# EAGLE design controller2.4 (EAGLE 7.6.0)
CNAME: timebox controller; CREVISION: 1.0; DESIGNER: volzo
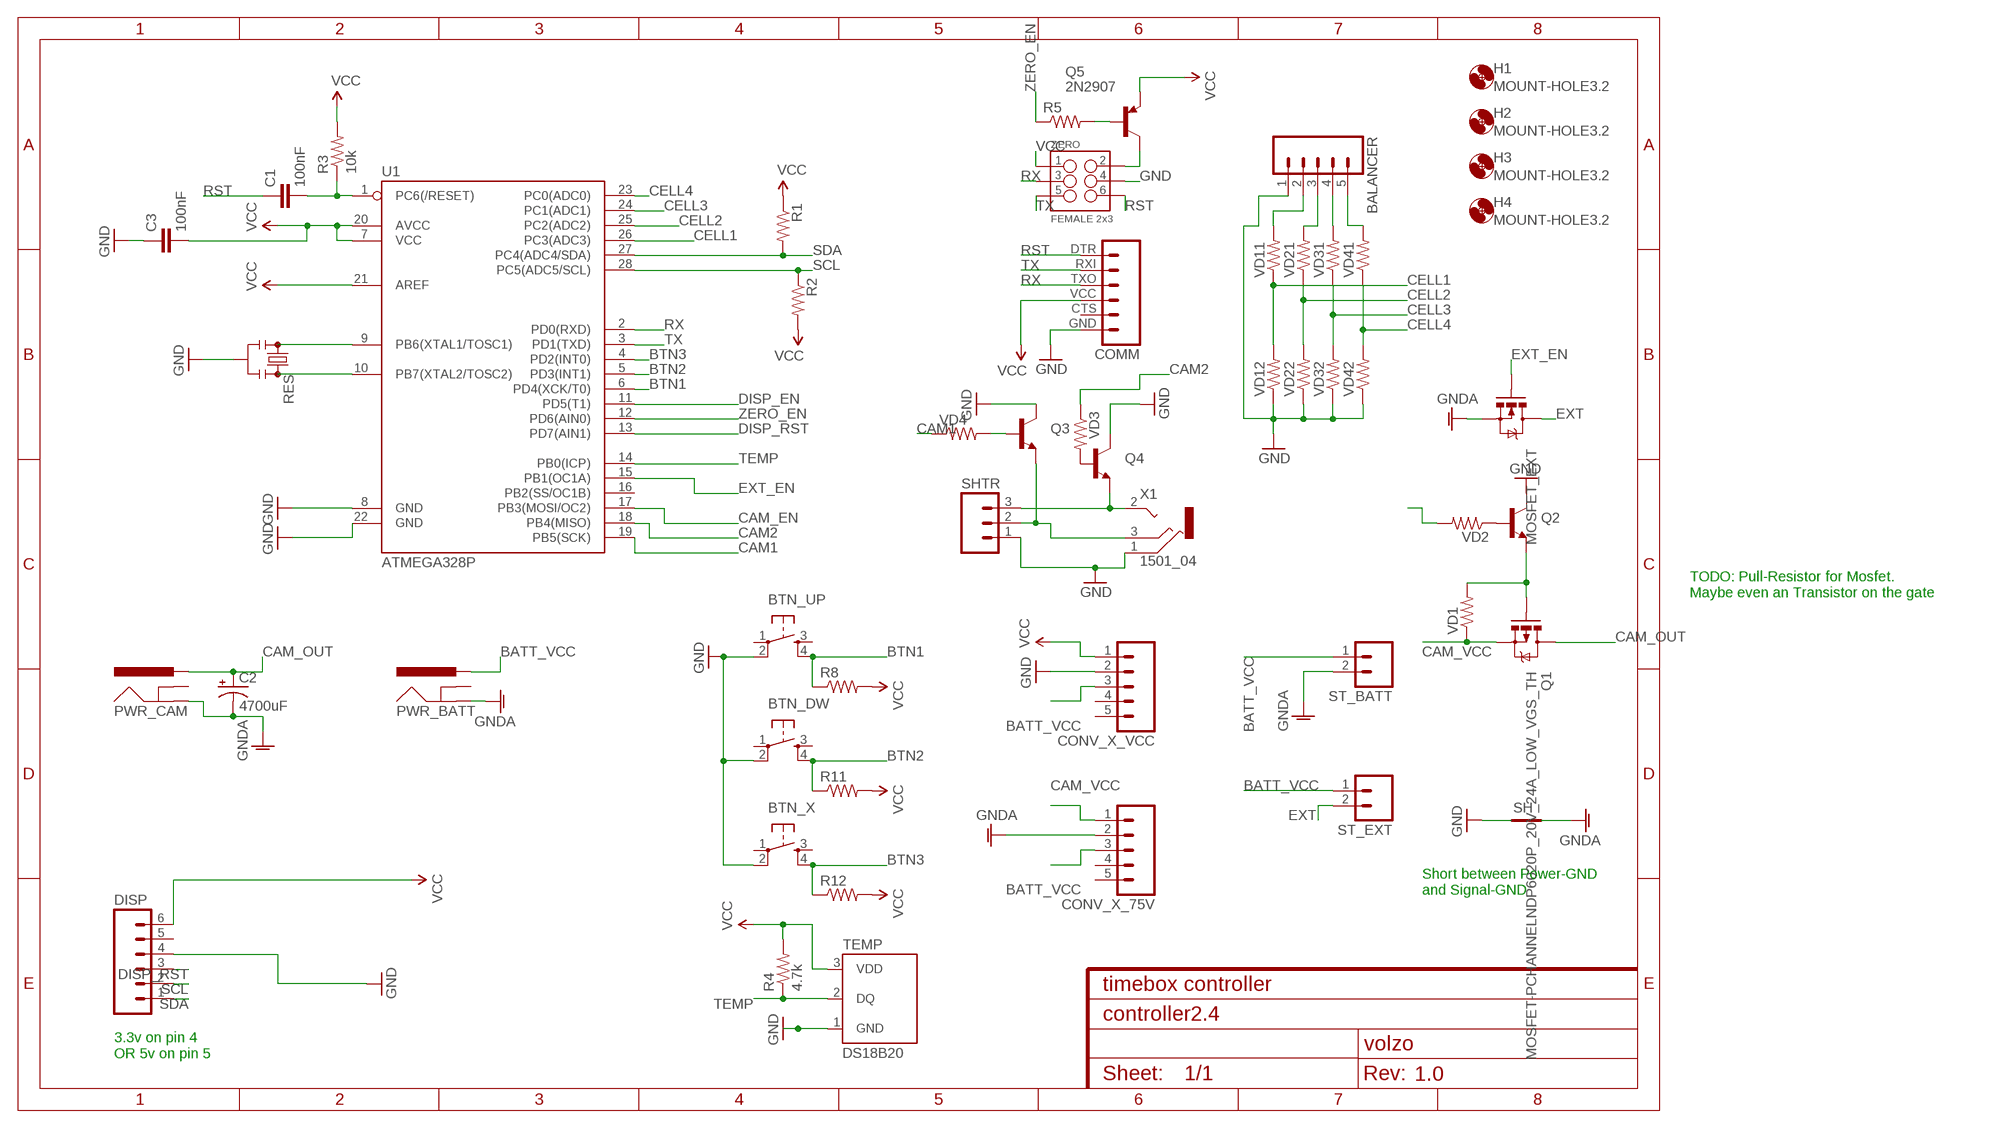
[diagram p0: schematic, sheet 1]

## Parts
BALANCER  M05LOCK  [1X05_LOCK]
BTN_DW  TAC_SWITCHPTH  [TACTILE-PTH]
BTN_UP  TAC_SWITCHPTH  [TACTILE-PTH]
BTN_X  TAC_SWITCHPTH  [TACTILE-PTH]
C1  100nF  CAPPTH  [CAP-PTH-SMALL]
C2  4700uF  CAP_POLPTH3  [CPOL-RADIAL-1000UF-63V]
C3  100nF  CAPPTH  [CAP-PTH-SMALL]
COMM  FTDI_BASICPTH  [FTDI_BASIC]
CONV_X_75V  M05LOCK  [1X05_LOCK]
CONV_X_VCC  M05LOCK  [1X05_LOCK]
DISP  M06FEMALE_LOCK  [1X06_FEMALE_LOCK.010]
H1  MOUNT-HOLE3.2  [3,2]
H2  MOUNT-HOLE3.2  [3,2]
H3  MOUNT-HOLE3.2  [3,2]
H4  MOUNT-HOLE3.2  [3,2]
MOSFET_EXT  MOSFET-NCHANNELFQP30N06L  [TO220V]
PWR_BATT  POWER_JACKPTH_BREAD  [POWER_JACK_PTH_BREAD]
PWR_CAM  POWER_JACKPTH_BREAD  [POWER_JACK_PTH_BREAD]
Q1  MOSFET-PCHANNELNDP6020P_20V_24A_LOW_VGS_TH  [TO220V]
Q2  TRANSISTOR_NPN2N3904  [TO-92]
Q3  TRANSISTOR_NPN2N3904  [TO-92]
Q4  TRANSISTOR_NPN2N3904  [TO-92]
Q5  2N2907  [TO92-EBC-OVAL]
R1  RESISTORAXIAL-0.3  [AXIAL-0.3]
R2  RESISTORAXIAL-0.3  [AXIAL-0.3]
R3  10k  RESISTORAXIAL-0.3  [AXIAL-0.3]
R4  4.7k  RESISTORAXIAL-0.3  [AXIAL-0.3]
R5  RESISTORAXIAL-0.3  [AXIAL-0.3]
R8  RESISTORAXIAL-0.3  [AXIAL-0.3]
R11  RESISTORAXIAL-0.3  [AXIAL-0.3]
R12  RESISTORAXIAL-0.3  [AXIAL-0.3]
RES  RESONATORPTH  [RESONATOR-PTH]
SH  SHORT-HT5  [SHORT_TOP-50]
SHTR  M03LOCK  [1X03_LOCK]
ST_BATT  M025MM  [SCREWTERMINAL-5MM-2]
ST_EXT  M025MM  [SCREWTERMINAL-5MM-2]
TEMP  DS18B20  [TO-92-AMMO]
U1  ATMEGA328P  ATMEGA328P_PDIP  [DIL28-3]
VD1  RESISTORAXIAL-0.3  [AXIAL-0.3]
VD2  RESISTORAXIAL-0.3  [AXIAL-0.3]
VD3  RESISTORAXIAL-0.3  [AXIAL-0.3]
VD4  RESISTORAXIAL-0.3  [AXIAL-0.3]
VD11  RESISTORAXIAL-0.3  [AXIAL-0.3]
VD12  RESISTORAXIAL-0.3  [AXIAL-0.3]
VD21  RESISTORAXIAL-0.3  [AXIAL-0.3]
VD22  RESISTORAXIAL-0.3  [AXIAL-0.3]
VD31  RESISTORAXIAL-0.3  [AXIAL-0.3]
VD32  RESISTORAXIAL-0.3  [AXIAL-0.3]
VD41  RESISTORAXIAL-0.3  [AXIAL-0.3]
VD42  RESISTORAXIAL-0.3  [AXIAL-0.3]
X1  1501_04  [1501_05]
ZERO  FEMALE 2x3  M03X2FEMALE  [2X3]

## Nets
BATT_VCC [power]: CONV_X_75V.3 CONV_X_VCC.3 PWR_BATT.PWR ST_BATT.1 ST_EXT.1
BTN1: BTN_UP.4 R8.P$1 U1.6(PD4(XCK/T0))
BTN2: BTN_DW.4 R11.P$1 U1.5(PD3(INT1))
BTN3: BTN_X.4 R12.P$1 U1.4(PD2(INT0))
CAM1: U1.19(PB5(SCK)) VD4.P$1
CAM2: U1.18(PB4(MISO)) VD3.P$1
CAM_EN: U1.17(PB3(MOSI/OC2)) VD2.P$2
CAM_OUT [power]: C2.1(+) PWR_CAM.PWR Q1.2(D)
CAM_VCC [power]: CONV_X_75V.1 Q1.3(S) VD1.P$1
CELL1: U1.26(PC3(ADC3)) VD11.P$1 VD12.P$2
CELL2: U1.25(PC2(ADC2)) VD21.P$1 VD22.P$2
CELL3: U1.24(PC1(ADC1)) VD31.P$1 VD32.P$2
CELL4: U1.23(PC0(ADC0)) VD41.P$1 VD42.P$2
DISP_EN: U1.11(PD5(T1))
DISP_RST: DISP.3 U1.13(PD7(AIN1))
EXT [power]: MOSFET_EXT.2(D) ST_EXT.2
EXT_EN: MOSFET_EXT.1(G) U1.15(PB1(OC1A))
GND: BALANCER.1 BTN_DW.2 BTN_UP.2 BTN_X.2 C3.1 COMM.GND CONV_X_VCC.2 DISP.4 Q2.3(C) Q3.3(C) Q4.3(C) RES.2 SH.1 SHTR.1 TEMP.1(GND) U1.8(GND) U1.22(GND) VD12.P$1 VD22.P$1 VD32.P$1 VD42.P$1 X1.1 ZERO.4
GNDA [power]: C2.2(-) CONV_X_75V.2 MOSFET_EXT.3(S) PWR_BATT.GND PWR_CAM.GND SH.2 ST_BATT.2
N$1: C1.2 R3.P$1 U1.1(PC6(/RESET))
N$2: Q1.1(G) Q2.1(E) VD1.P$2
N$3: Q3.1(E) SHTR.2 X1.3
N$4: BALANCER.2 VD11.P$2
N$5: BALANCER.3 VD21.P$2
N$6: Q4.1(E) SHTR.3 X1.2
N$7: Q2.2(B) VD2.P$1
N$8: RES.3 U1.10(PB7(XTAL2/TOSC2))
N$9: RES.1 U1.9(PB6(XTAL1/TOSC1))
N$10: BALANCER.4 VD31.P$2
N$11: BALANCER.5 VD41.P$2
N$12: Q5.C ZERO.2
N$13: Q3.2(B) VD4.P$2
N$14: Q4.2(B) VD3.P$2
N$15: Q5.B R5.P$2
RST: C1.1 COMM.DTR ZERO.6
RX: COMM.TXO U1.2(PD0(RXD)) ZERO.3
SCL: DISP.2 R2.P$1 U1.28(PC5(ADC5/SCL))
SDA: DISP.1 R1.P$2 U1.27(PC4(ADC4/SDA))
TEMP: R4.P$1 TEMP.2(DQ) U1.14(PB0(ICP))
TX: COMM.RXI U1.3(PD1(TXD)) ZERO.5
VCC: C3.2 COMM.VCC CONV_X_VCC.1 DISP.6 Q5.E R1.P$1 R2.P$2 R3.P$2 R4.P$2 R8.P$2 R11.P$2 R12.P$2 TEMP.3(VDD) U1.7(VCC) U1.20(AVCC) U1.21(AREF) ZERO.1
ZERO_EN: R5.P$1 U1.12(PD6(AIN0))
Unconnected: BTN_DW.1 BTN_DW.3 BTN_UP.1 BTN_UP.3 BTN_X.1 BTN_X.3 COMM.CTS CONV_X_75V.4 CONV_X_75V.5 CONV_X_VCC.4 CONV_X_VCC.5 DISP.5 PWR_BATT.GNDBREAK PWR_CAM.GNDBREAK U1.16(PB2(SS/OC1B))

## Notes on the sheet
- TODO: Pull-Resistor for Mosfet.
  Maybe even an Transistor on the gate
- Short between Power-GND
  and Signal-GND
- 3.3v on pin 4
  OR 5v on pin 5

## Library data of the parts
BALANCER CONV_X_75V CONV_X_VCC = SparkFun-Connectors:M05: Header 5 Standard 5-pin 0.1" header. Use with straight break away headers (SKU : PRT-00116), right angle break away headers (PRT-00553), swiss pins (PRT-00743), machine pins (PRT-00117), and female headers (PRT-00115). Molex polarized connector foot print use with SKU : PRT-08230 with associated crimp pins and housings.
BTN_DW BTN_UP BTN_X = SparkFun-Retired:TAC_SWITCH: Momentary Switch Button commonly used for reset or general input. Spark Fun Electronics SKU : COM-00097 SMT- SWCH-08247
C1 C3 = SparkFun-Passives:CAP: Capacitor Standard 0603 ceramic capacitor, and 0.1" leaded capacitor.
C2 = SparkFun-Passives:CAP_POL: Capacitor Polarized These are standard SMD and PTH capacitors. Normally 10uF, 47uF, and 100uF in electrolytic and tantalum varieties. Always verify the external diameter of the through hole cap, it varies with capacity, voltage, and manufacturer. The EIA devices should be standard.
COMM = SparkFun-Connectors:FTDI_BASIC: FTDI Basic header with labels
DISP = SparkFun-Connectors:M06: Header 6 Standard 6-pin 0.1" header. Use with straight break away headers (SKU : PRT-00116), right angle break away headers (PRT-00553), swiss pins (PRT-00743), machine pins (PRT-00117), and female headers (PRT-00115). Molex polarized connector foot print use with SKU : PRT-08094 with associated crimp pins and housings. NOTES ON THE VARIANTS LOCK and LOCK_LONGPADS... This footprint was designed to help hold the alignment of a through-hole component (i.e. 6-pin header) while soldering it into place. You may notice that each hole has been shifted either up or down by 0.005 of an inch from it's more standard position (which is a perfectly straight line). This slight alteration caused the pins (the squares in the middle) to touch the edges of the holes. Because they are alternating, it causes a "brace" to hold the component in place. 0.005 has proven to be the perfect amount of "off-center" position when using our standard breakaway headers. Although looks a little odd when you look at the bare footprint, once you have a header in there, the alteration is very hard to notice. Also,if you push a header all the way into place, it is covered up entirely on the bottom side. This idea of altering the position of holes to aid alignment will be further integrated into the Sparkfun Library for other footprints. It can help hold any component with 3 or more connection pins.
H1-H4 = holes:MOUNT-HOLE: MOUNTING HOLE with drill center marker
MOSFET_EXT = SparkFun-DiscreteSemi:MOSFET-NCHANNEL: Common NMOSFET Parts MFG P/N Store ID Prod ID FDD8780 TRANS-09984 SI7820DN TRANS-11055 FDS6630A IC-08089 2N7002PW TRANS-11151 FQP30N06L COM-10213 TRANS-10060 BSS123LT1G TRANS-08345 BSS138 TRANS-00830 BS170 2N7000; PROD_ID: TRANS-10060
PWR_BATT PWR_CAM = SparkFun-Connectors:POWER_JACK: Power Jack This is the standard 5.5mm barrel jack for power. The PTH is the most common, proven, reliable, footprint. The Slot footprint only works if the mill layer is transmitted to the PCB fab house so be warned. Mating wall wart : TOL-00298 (and others); PROD_ID: PRT-10811
Q1 = SparkFun-DiscreteSemi:MOSFET-PCHANNEL: Generic PMOSFET IRLML2244 - TRANS-11153 (SOT-23 -20V -4.3A) (1.Gate 2.Source 3.Drain) FQP27P06 - COM-10349 <http://www.sparkfun.com/products/10349> (TO-220 -60V -27A) (1.Gate 2.Source 3.Drain); PROD_ID: TRANS-13060
Q2-Q4 = SparkFun-DiscreteSemi:TRANSISTOR_NPN: Generic NPN BJT MMBT2222A - TRANS-08049 (SOT-23, 1A 40V) MPSA42 - TRANS-09116 (SOT-23, 500mA 300V) MMBT5088LT1G - TRANS-11160 (SOT-23, 50 mA 30V) BC547 - COM-08928 <http://www.sparkfun.com/products/8928> (TO-92 45V 100mA) (1.Collector 2.Base 3.Emitter) 2N3904 - COM-00521 <http://www.sparkfun.com/products/521> (TO-92 40V 200mA) (1.Emitter 2.Base 3.Collector) P2N2222A - COM-12852 <http://www.sparkfun.com/products/12852> (TO-92 40V 600mA) (1.Collector 2.Base 3.Emitter); PROD_ID: TRANS-08447
Q5 = adafruit:2N2907*: PNP Transistor Big Oval pads
R1-R5 R8 R11 R12 VD1-VD4 VD11 VD12 VD21 VD22 VD31 VD32 VD41 VD42 = SparkFun-Resistors:RESISTOR: Resistor Basic schematic elements and footprints for 0603, 1206, and PTH resistors.
RES = SparkFun-FreqCtrl:RESONATOR: Resonator Small SMD resonator. Used, eg, on the Arduino Pro/ Pro Mini boards. 8MHz- XTAL-08895 16MHz- XTAL-08900
SH = shorts-old:SHORT-H: Short between two nets; BOM: no
SHTR = SparkFun-Connectors:M03: Header 3 Standard 3-pin 0.1" header. Use with straight break away headers (SKU : PRT-00116), right angle break away headers (PRT-00553), swiss pins (PRT-00743), machine pins (PRT-00117), and female headers (PRT-00115). Molex polarized connector foot print use with SKU : PRT-08232 with associated crimp pins and housings.
ST_BATT ST_EXT = SparkFun-Connectors:M02: Standard 2-pin 0.1" header. Use with - straight break away headers ( PRT-00116) - right angle break away headers (PRT-00553) - swiss pins (PRT-00743) - machine pins (PRT-00117) - female headers (PRT-00115) Molex polarized connector foot print use with: PRT-08233 with associated crimp pins and housings. 2.54_SCREWTERM for use with PRT-10571. 3.5mm Screw Terminal footprints for PRT-08084 5mm Screw Terminal footprints for use with PRT-08432; STOREFRONT_ID: PRT-08432
TEMP = SparkFun-Sensors:DS18B20: Dallas/Maxim DS18B20 1-wire temperature sensor Datasheet: http://datasheets.maximintegrated.com/en/ds/DS18B20.pdf temp thermometer 1-wire one-wire one wire; STORE_ID: SEN-00245
U1 = SparkFun-DigitalIC:ATMEGA328P_PDIP: uC used in the Arduino 32kb flash, 1k EEPROM, 2k SRAM This is the through-hole version of this chip.
X1 = con-lumberg:1501_0*: Jack connectors according to JISC 6560, 2.5 mm Klinkensteckverbinder nach JISC 6560, 2,5 mm Source: http://www.lumberg.com/Produkte/PDFs/1501_05.pdfedit 1501_03 http://www.lumberg.com/Produkte/PDFs/1501_06.pdf; OC_FARNELL: 1216977; OC_NEWARK: unknown
ZERO = SparkFun-Connectors:M03X2: 2x3 .1" header. Shrouded, with keying- CONN-10681 SMT- CONN-11415 Pogo pins- HW-11044; PROD_ID: CONN-11566

## Net classes
0 default: width 0.254 mm
1 power: width 0.762 mm, clearance 0.254 mm

## Board
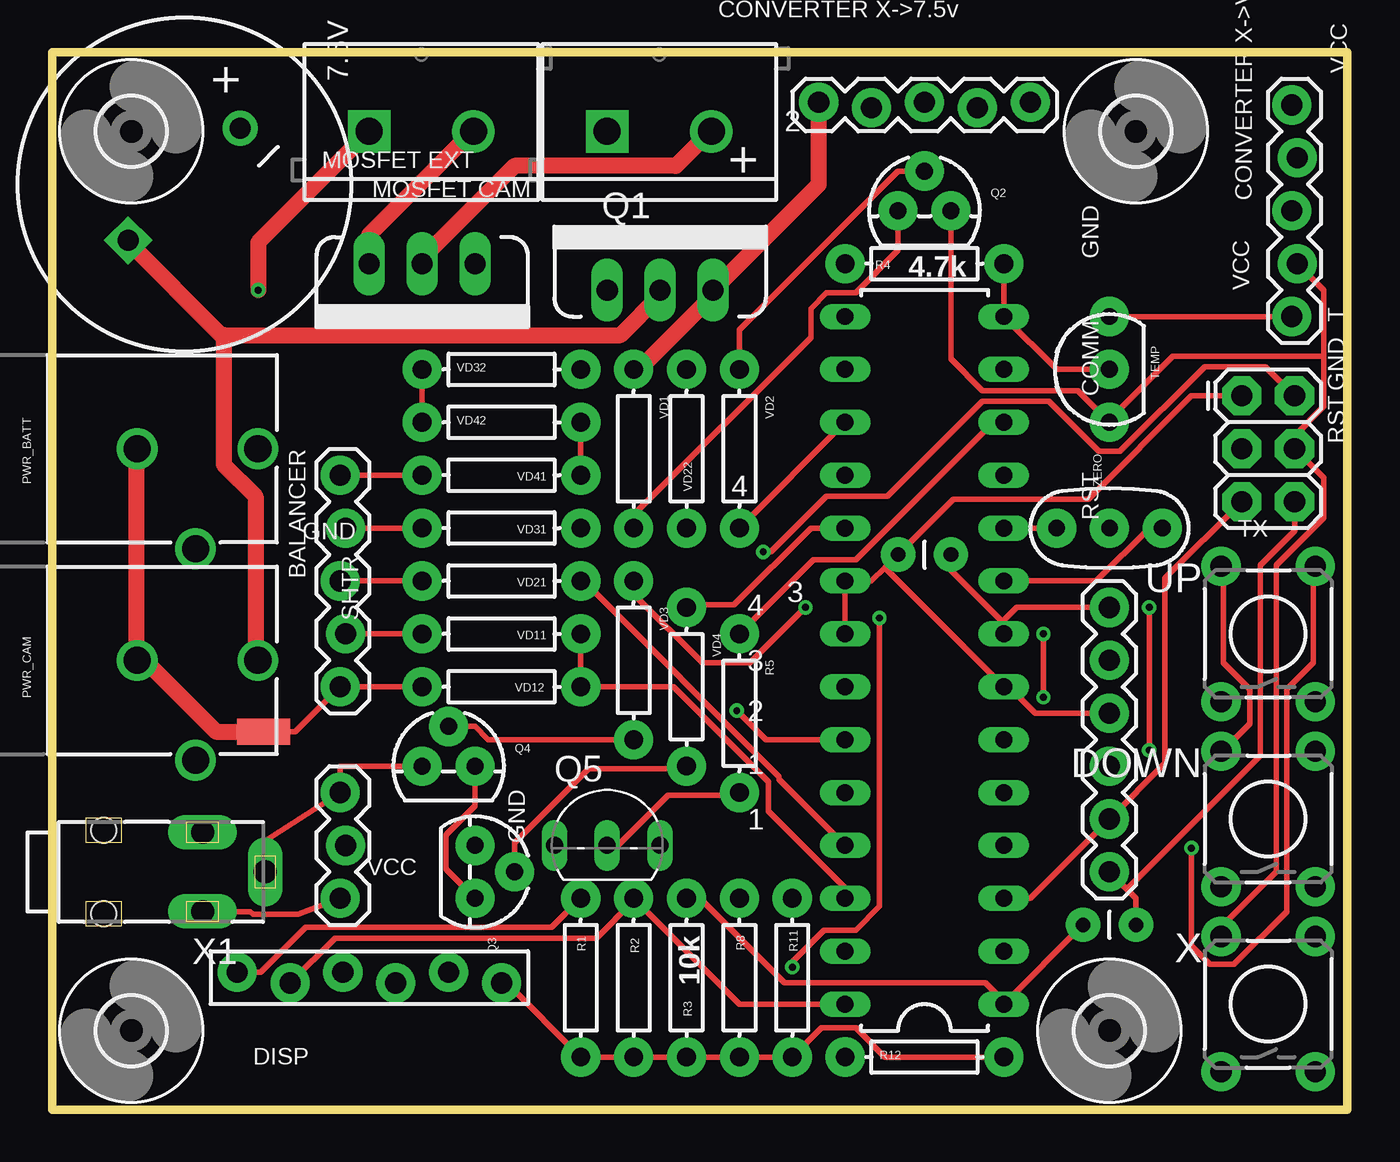
[diagram p1: board, top side]
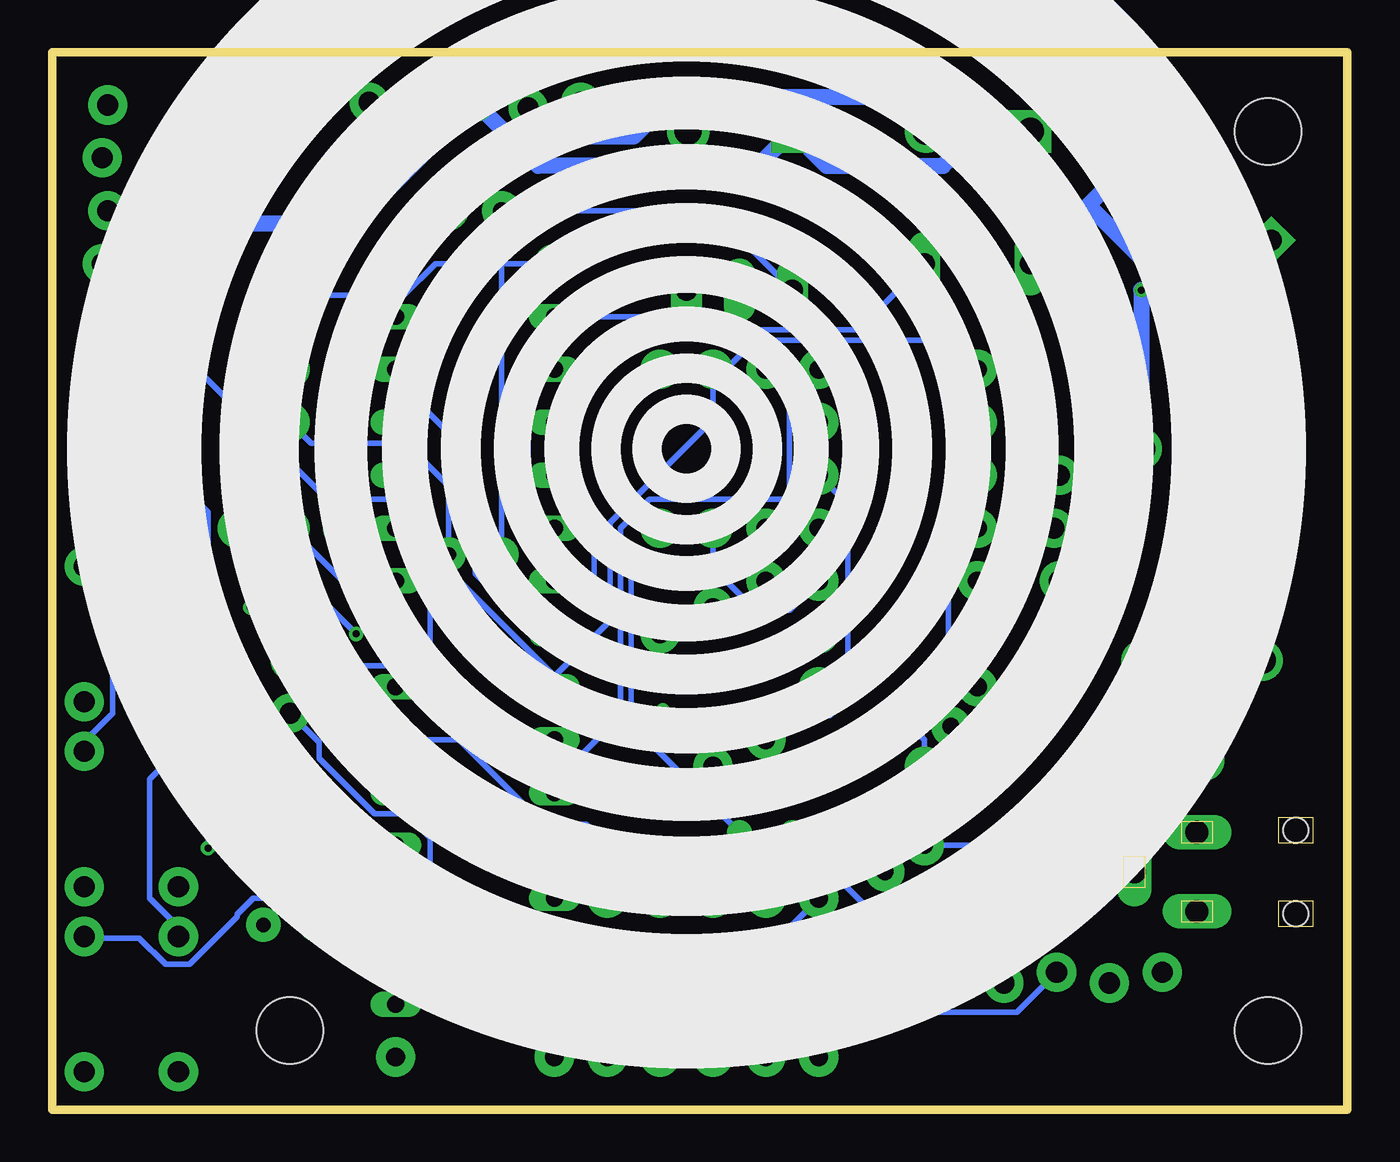
[diagram p2: board, bottom side, seen from below]

Size 62.23 x 50.8 mm. Coordinates in mm from the lower left corner, seen from the top.
Outline: 0,0 62.23,0 62.23,50.8 0,50.8 0,0
Copper layers (1*16): Top 0.0356mm / dielectric 1.5011mm / Bottom 0.0356mm
Design rules "oshpark-2layer *": minimum track width 6mil, minimum drill 13mil, track to track 10mil, track to pad 10mil, pad to pad 10mil, via to via 10mil, smd to smd 10mil, copper to edge 15mil, drill to drill 6mil, minimum pad ring 7mil, minimum via ring 7mil, stop-mask expansion 2.5mil, vias tented up to drill 0mil, thermal gap 10mil

### Footprints (pad centres in the part's own frame; a part is rotated, then mirrored left to right if it is on the bottom)
1X05_LOCK = drill 1.016 pad 1.88: 1 0,0.127; 2 2.54,-0.127; 3 5.08,0.127; 4 7.62,-0.127; 5 10.16,0.127
TACTILE-PTH = drill 1.016 pad 1.88: 1 -3.251,2.261; 2 3.251,2.261; 3 -3.251,-2.261; 4 3.251,-2.261
CAP-PTH-SMALL = drill 0.7 pad 1.651: 1 0,0; 2 2.54,0
CPOL-RADIAL-1000UF-63V = drill 1.016 pad 1.651 square: 1 3.81,0 | drill 1.016 pad 1.676: 2 -3.81,0
FTDI_BASIC = drill 1.016 pad 1.88: CTS 10.16,0; DTR 0,0; GND 12.7,0; RXI 2.54,0; TXO 5.08,0; VCC 7.62,0
1X06_FEMALE_LOCK.010 = drill 1.016 pad 1.88: 1 0,0.254; 2 2.54,-0.254; 3 5.08,0.254; 4 7.62,-0.254; 5 10.16,0.254; 6 12.7,-0.254
3,2 = hole 3.2: 0,0
TO220V = drill 1.016 long: 1 -2.54,0; 2 0,0; 3 2.54,0
POWER_JACK_PTH_BREAD = drill 1.3: GND 0,7.9; GNDBREAK 4.8,10.7; PWR 0,13.7
TO-92 = drill 0.813 pad 1.88: 1 -1.27,0; 2 0,1.905; 3 1.27,0
TO92-EBC-OVAL = drill 0.813 long: B 0,-1.27; C 2.54,-1.27; E -2.54,-1.27
AXIAL-0.3 = drill 0.9 pad 1.88: P$1 -3.81,0; P$2 3.81,0
RESONATOR-PTH = drill 0.8 pad 1.88: 1 -2.54,0; 2 0,0; 3 2.54,0
SHORT_TOP-50 = smd 1.27 x 1.27: 1 0.635,0; 2 -0.635,0
1X03_LOCK = drill 1.016 pad 1.88: 1 0,0.127; 2 2.54,-0.127; 3 5.08,0.127
SCREWTERMINAL-5MM-2 = drill 1.3 pad 2.032 square: 1 0,0 | drill 1.3 pad 2.032: 2 5,0
TO-92-AMMO = drill 0.813 pad 1.88: 1 -2.54,0; 2 0,0; 3 2.54,0
DIL28-3 = drill 0.813 long: 1 -16.51,-3.81; 2 -13.97,-3.81; 3 -11.43,-3.81; 4 -8.89,-3.81; 5 -6.35,-3.81; 6 -3.81,-3.81; 7 -1.27,-3.81; 8 1.27,-3.81; 9 3.81,-3.81; 10 6.35,-3.81; 11 8.89,-3.81; 12 11.43,-3.81; 13 13.97,-3.81; 14 16.51,-3.81; 15 16.51,3.81; 16 13.97,3.81; 17 11.43,3.81; 18 8.89,3.81; 19 6.35,3.81; 20 3.81,3.81; 21 1.27,3.81; 22 -1.27,3.81; 23 -3.81,3.81; 24 -6.35,3.81; 25 -8.89,3.81; 26 -11.43,3.81; 27 -13.97,3.81; 28 -16.51,3.81
1501_05 = drill 1.1 pad 1.4 long: 1 -1.9,-8.5; 2 0,-11.5; 3 1.9,-8.5 | hole 1.2: -2,-3.75; 2,-3.75
2X3 = drill 1.016 pad 1.88 octagon: 1 0,0; 2 0,2.54; 3 2.54,0; 4 2.54,2.54; 5 5.08,0; 6 5.08,2.54

### Placement (x,y rotation side)
BALANCER  13.97,20.32 90 top
BTN_DW  58.42,13.97 90 top
BTN_UP  58.42,22.86 90 top
BTN_X  58.42,5.08 90 top
C1  52.07,8.89 180 top
C2  6.35,44.45 225 top
C3  43.18,26.67 180 top
COMM  50.8,11.43 90 top
CONV_X_75V  36.83,48.26 0 top
CONV_X_VCC  59.69,38.1 90 top
DISP  8.89,6.35 0 top
H1  3.81,46.99 0 top
H2  50.8,3.81 0 top
H3  52.07,46.99 0 top
H4  3.81,3.81 0 top
MOSFET_EXT  17.78,40.64 180 top
PWR_BATT  -3.81,31.75 270 top
PWR_CAM  -3.81,21.59 270 top
Q1  29.21,39.37 0 top
Q2  41.91,43.18 0 top
Q3  20.32,11.43 270 top
Q4  19.05,16.51 0 top
Q5  26.67,13.97 0 top
R1  25.4,6.35 90 top
R2  27.94,6.35 270 top
R3  30.48,6.35 270 top
R4  41.91,40.64 180 top
R5  33.02,19.05 270 top
R8  33.02,6.35 270 top
R11  35.56,6.35 270 top
R12  41.91,2.54 0 top
RES  50.8,27.94 180 top
SH  10.16,18.16 0 top
SHTR  13.97,10.16 90 top
ST_BATT  15.24,46.99 0 top
ST_EXT  26.67,46.99 0 top
TEMP  50.8,35.56 90 top
U1  41.91,21.59 90 top
VD1  27.94,31.75 270 top
VD2  33.02,31.75 270 top
VD3  27.94,21.59 270 top
VD4  30.48,20.32 270 top
VD11  21.59,22.86 180 top
VD12  21.59,20.32 0 top
VD21  21.59,25.4 180 top
VD22  30.48,31.75 270 top
VD31  21.59,27.94 180 top
VD32  21.59,35.56 0 top
VD41  21.59,30.48 180 top
VD42  21.59,33.02 0 top
X1  -1.27,11.43 90 top
ZERO  57.15,34.29 270 top

### Tracks (layer width: path | path; a pad name or v marks a point on that pad's centre or on a via)
BATT_VCC  (via drill 0.33)
  Top 0.762: v9.91,39.37 9.91,41.66 ST_BATT.1
  Bottom 0.762: v9.91,39.37 9.91,31.75 PWR_BATT.PWR | CONV_X_VCC.3 54.48,43.18 53.85,42.55 47.75,42.55 CONV_X_75V.3 38.86,45.34 28.32,45.34 ST_EXT.1 25.02,45.34 19.43,45.34 17.78,46.99 ST_BATT.1
BTN1  (via drill 0.33)
  Top 0.254: v54.74,12.57 54.74,7.87 55.63,6.99 56.77,6.99 59.31,9.53 59.31,20.19 60.58,21.46 60.58,26.04 BTN_UP.4 | v52.7,24.13 v52.7,17.27 | v47.62,19.81 v47.62,22.86
  Bottom 0.254: 45.59,17.78 42.67,17.78 38.61,13.72 36.58,13.72 R8.P$1 | v54.74,12.57 54.74,15.24 v52.7,17.27 | v52.7,24.13 51.31,25.53 50.29,25.53 v47.62,22.86 | 45.59,17.78 v47.62,19.81 | 45.59,17.78 U1.6
BTN2
  Bottom 0.254: R11.P$1 36.58,11.18 38.61,11.18 42.67,15.24 U1.5 48.39,17.91 48.39,20.19 47.24,21.34 45.21,21.34 44.07,22.48 44.07,25.78 44.45,26.16 44.45,27.18 44.07,27.56 44.07,28.32 45.09,29.34 49.02,29.34 55.37,35.69 60.2,35.69 61.09,34.8 61.09,28.7 59.31,26.92 59.31,19.05 60.58,17.78 60.58,17.27 BTN_DW.4
BTN3
  Bottom 0.254: U1.4 45.72,12.19 42.35,8.83 | 42.35,8.83 39.75,6.22 39.75,4.19 R12.P$1 | 42.35,8.83 44.58,6.6 46.74,6.6 47.37,7.24 47.37,8.51 49.02,10.16 50.04,10.16 50.16,10.03 51.31,10.03 51.44,10.16 52.58,10.16 53.34,9.4 53.34,9.27 55.63,6.99 56.77,6.99 58.04,8.26 60.58,8.26 BTN_X.4
CAM1
  Top 0.254: U1.19 36.45,27.94 32.77,24.26 30.61,24.26 VD4.P$1
CAM2  (via drill 0.33)
  Top 0.254: v36.2,24.13 33.53,21.46 31.24,21.46 27.94,24.77 VD3.P$1
  Bottom 0.254: U1.18 38.1,29.97 36.2,28.07 v36.2,24.13
CAM_EN
  Top 0.254: VD2.P$2 U1.17
CAM_OUT
  Top 0.762: Q1.2 29.21,39.12 27.3,37.21 8.26,37.21 | 8.26,37.21 8.13,37.21 3.68,41.66 C2.1 | 8.26,37.21 8.26,30.99 9.78,29.46 9.78,21.59 PWR_CAM.PWR
CAM_VCC
  Top 0.762: VD1.P$1 28.19,35.56 31.75,39.12 Q1.3 36.83,44.45 CONV_X_75V.1
CELL1
  Top 0.254: U1.26 38.1,10.67 34.42,14.35 34.42,15.75 29.84,20.32 VD12.P$2 VD11.P$1
CELL2
  Top 0.254: U1.25 34.92,15.88 34.92,16 25.53,25.4 VD21.P$1
  Bottom 0.254: VD22.P$2 30.48,26.04 28.45,24 26.8,24 VD21.P$1
CELL3
  Bottom 0.254: U1.24 38.1,15.75 34.92,18.92 34.92,27.94 33.53,29.34 26.8,29.34 | VD31.P$1 26.8,29.34 | VD32.P$2 25.4,34.92 26.8,33.53 26.8,29.34
CELL4  (via drill 0.33)
  Top 0.254: U1.23 34.29,17.78 v32.89,19.18 | VD41.P$1 VD42.P$2
  Bottom 0.254: v32.89,19.18 26.16,19.18 25.91,18.92 24.89,18.92 24,19.81 24,29.08 VD41.P$1
DISP_RST  (via drill 0.33)
  Top 0.254: v39.75,23.62 39.75,9.78 38.61,8.64 37.08,8.64 35.56,7.11 v35.56,6.86
  Bottom 0.254: U1.13 45.72,35.05 41.91,31.24 41.91,25.78 v39.75,23.62 | v35.56,6.86 24.26,6.86 22.1,4.7 15.88,4.7 DISP.3
EXT
  Top 0.762: MOSFET_EXT.2 17.78,40.89 22.23,45.34 29.97,45.34 31.62,46.99 ST_EXT.2
EXT_EN
  Bottom 0.254: U1.15 32.89,38.1 32.26,37.47 23.5,37.47 MOSFET_EXT.1
GND
  Top 0.254: VD32.P$1 VD42.P$1 | SH.1 11.68,18.16 BALANCER.1 VD12.P$1 | SHTR.1 11.81,9.4 9.65,9.4 9.53,9.53 X1.1 | Q4.3 20.32,14.61 18.92,13.21 18.92,11.56 Q3.3 | U1.8 45.72,23.37 45.66,23.43 | 45.66,23.43 43.18,25.91 C3.1 | COMM.GND 46.35,24.13 45.66,23.43 | BTN_UP.2 56.26,26.04 56.26,21.46 57.53,20.19 57.53,18.54 56.26,17.27 BTN_DW.2 | 61.09,36.2 61.09,39.37 CONV_X_VCC.2 | 61.09,36.2 61.09,33.78 59.69,32.38 ZERO.4 61.09,30.35 61.09,28.45 58.8,26.16 58.8,11.43 56.26,8.89 56.26,8.38 BTN_X.2 | Q2.3 43.18,36.07 44.7,34.54 49.28,34.54 TEMP.1 50.8,33.15 53.85,36.2 61.09,36.2
  Bottom 0.254: VD32.P$1 19.18,36.96 28.45,36.96 29.84,35.56 VD22.P$1 30.48,33.15 35.43,28.19 35.43,23.5 38.1,20.83 | Q4.3 20.32,17.78 20.45,17.91 20.45,18.92 19.11,20.26 | 19.11,20.26 19.05,20.32 VD12.P$1 | Q3.3 16.51,6.35 DISP.4 16.51,6.48 12.83,10.16 SHTR.1 | VD42.P$1 17.78,32.38 19.18,30.99 19.18,20.32 19.11,20.26 | 38.1,20.83 43.18,25.91 C3.1 43.18,29.97 45.21,32 49.78,32 TEMP.1 | U1.8 RES.2 | BTN_X.2 56.26,8.38 56.26,8.89 57.53,10.16 57.53,15.88 56.26,17.14 BTN_DW.2 | 38.1,20.83 U1.22
GNDA
  Top 0.762: SH.2 7.87,18.16 4.45,21.59 PWR_CAM.GND 4.06,21.84 4.06,31.75 PWR_BATT.GND | MOSFET_EXT.3 15.24,42.04 20.19,46.99 ST_BATT.2
  Bottom 0.762: MOSFET_EXT.3 12.45,43.43 | 12.45,43.43 9.14,46.74 9.14,47.12 C2.2 | CONV_X_75V.2 38.86,48.13 37.47,46.74 34.29,46.74 32.38,48.64 21.97,48.64 20.32,46.99 ST_BATT.2 | 12.45,43.43 4.19,35.18 4.19,31.75 PWR_BATT.GND
N$1
  Top 0.254: C1.2 U1.1 45.72,5.21 44.83,6.1 35.18,6.1 31.11,10.16 R3.P$1
N$2
  Top 0.254: VD1.P$2 27.94,28.57 36.45,37.08 36.45,38.48 37.21,39.24 38.61,39.24 40.64,41.27 Q2.1
  Bottom 0.254: Q1.1 30.48,43.18 Q2.1
N$3
  Bottom 0.254: X1.3 9.53,13.34 9.65,13.46 12.06,13.46 SHTR.2 Q3.1
N$4
  Top 0.254: VD11.P$2 BALANCER.2
N$5
  Top 0.254: VD21.P$2 BALANCER.3
N$6
  Top 0.254: X1.2 10.29,11.43 10.29,12.95 SHTR.3 13.84,16.51 Q4.1
N$7
  Top 0.254: VD2.P$1 33.02,37.47 40.64,45.09 Q2.2
N$8
  Top 0.254: RES.3 U1.10
N$9
  Top 0.254: U1.9 50.16,25.4 52.7,27.94 RES.1
N$10
  Top 0.254: VD31.P$2 BALANCER.4
N$11
  Top 0.254: VD41.P$2 BALANCER.5
N$12  (via drill 0.33)
  Top 0.254: v34.16,26.8 34.54,26.8 37.21,29.46 40.13,29.46 44.7,34.04 47.88,34.04 50.29,31.62 51.31,31.62 55.37,35.69 58.29,35.69 ZERO.2
  Bottom 0.254: Q5.C 29.21,13.34 34.42,18.54 34.42,26.54 v34.16,26.8
N$13
  Top 0.254: Q3.2 22.23,12.83 25.78,16.38 30.35,16.38 VD4.P$2
N$14
  Top 0.254: VD3.P$2 20.95,17.78 20.32,18.41 Q4.2
N$15
  Top 0.254: Q5.B 27.18,12.7 29.59,15.11 32.89,15.11 R5.P$2
RST
  Top 0.254: C1.1 52.07,10.16 51.63,10.6 | COMM.DTR 51.63,10.6 | ZERO.6 59.69,27.81 58.04,26.16 58.04,17.02 51.63,10.6
RX
  Bottom 0.254: U1.2 45.72,8.13 49.4,11.81 49.4,15.11 COMM.TXO 54.74,20.45 54.74,28.7 57.15,31.11 ZERO.3
SCL
  Top 0.254: U1.28 33.02,5.08 R2.P$1 27.94,10.03 26.16,8.26 13.59,8.26 DISP.2
SDA
  Top 0.254: DISP.1 10.03,6.6 12.19,8.76 24,8.76 R1.P$2
  Bottom 0.254: U1.27 27.94,7.62 R1.P$2
TEMP
  Top 0.254: R4.P$1 U1.14 48.26,35.56 TEMP.2
TX
  Top 0.254: U1.3 46.99,10.16 COMM.RXI 53.47,16.64 53.47,25.53 ZERO.5
VCC
  Top 0.254: R12.P$2 40.01,2.54 38.61,3.94 36.96,3.94 R11.P$2 R8.P$2 R3.P$2 R2.P$2 R1.P$1 21.84,6.1 DISP.6 | CONV_X_VCC.1 TEMP.3 | COMM.VCC 47.24,19.05 45.97,20.32 U1.7 40.01,26.04 | U1.21 U1.20 39.37,25.4 40.01,26.04 | 40.01,26.04 C3.2 43.31,29.34 49.78,29.34 54.74,34.29 ZERO.1
  Bottom 0.254: Q5.E 24.13,10.79 21.59,8.26 DISP.6 | 40.64,40.64 43.81,40.64 45.34,39.12 49.78,39.12 TEMP.3 | 40.64,40.64 R4.P$2 | C3.2 40.64,40.64 | R11.P$2 35.56,4.57 37.59,6.6 39.12,6.6 44.07,11.56 44.07,13.08 45.21,14.22 46.74,14.22 49.4,16.89 49.4,17.65 COMM.VCC
ZERO_EN
  Top 0.254: U1.12 45.21,33.02 38.61,26.42 36.58,26.42 R5.P$1

### Text on the board
tPlace: X | X | CONVERTER X->7.5v | TIME | VCC | + | 7.5V | 2 | + | MOSFET EXT | MOSFET CAM | CONVERTER X->VCC | BOX | GND | VCC | T | GND | COMM | RST | 4 | GND | RST | TX | BALANCER | UP | 4 | 3 | SHTR | 3 | 2 | DOWN | 1 | GND | 1 | VCC | X | DISP